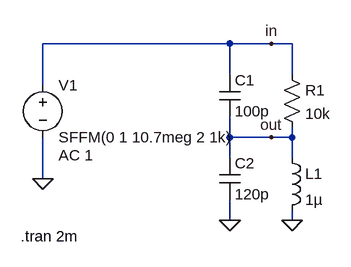
[diagram p0: schematic FM detector.asc]
FM detector.asc, the LTspice schematic file:
Version 4
SHEET 1 880 680
WIRE 256 48 -32 48
WIRE 320 48 256 48
WIRE 352 48 320 48
WIRE 256 96 256 48
WIRE 352 96 352 48
WIRE -32 112 -32 48
WIRE 256 192 256 160
WIRE 320 192 256 192
WIRE 352 192 352 176
WIRE 352 192 320 192
WIRE 256 224 256 192
WIRE 352 224 352 192
WIRE -32 256 -32 192
WIRE 256 320 256 288
WIRE 352 320 352 304
FLAG 352 320 0
FLAG 256 320 0
FLAG -32 256 0
FLAG 320 48 in
FLAG 320 192 out
SYMBOL cap 240 96 R0
SYMATTR InstName C1
SYMATTR Value 100p
SYMBOL cap 240 224 R0
SYMATTR InstName C2
SYMATTR Value 120p
SYMBOL ind 336 208 R0
SYMATTR InstName L1
SYMATTR Value 1µ
SYMATTR SpiceLine Rser=1
SYMBOL voltage -32 96 R0
WINDOW 123 24 124 Left 2
WINDOW 39 0 0 Left 0
SYMATTR InstName V1
SYMATTR Value SFFM(0 1 10.7meg 2 1k)
SYMATTR Value2 AC 1
SYMBOL res 336 80 R0
SYMATTR InstName R1
SYMATTR Value 10k
TEXT -66 344 Left 2 !.tran 2m

The netlist it stands for:
* FM detector.asc
C1 in out 100p
C2 out 0 120p
L1 out 0 1µ Rser=1
V1 in 0 SFFM(0 1 10.7meg 2 1k) AC 1
R1 in out 10k
.tran 2m
.backanno
.end